# Altium schematic sheet PROC054D_AWR_Power_Decoupling.SchDoc: DECOUPLING_CAPS_1
size 558 x 431 mm; Date: Not shown in title block; ApprovedBy: Not shown in title block; CheckedBy: Not shown in title block; Author: Not shown in title block; CompanyName: Not shown in title block; DrawnBy: a0271760; Engineer: Not shown in title block; Organization: Not shown in title block; Address1: Not shown in title block; Address2: Not shown in title block; Address3: Not shown in title block; Address4: Not shown in title block; DocumentNumber: 11; Revision: Use project pAWRameter SCH_Rev; SheetNumber: 11; SheetTotal: 19; PageSetup: Record=PageOptions|CenterHorizontal=True|CenterVertical=True|PrintScale=1.00|XCorrection=1.00|YCorrection=1.00|PrintKind=0|BorderSize=5000000|LeftOffset=0|BottomOffset=0|Orientation=2|PaperLength=1000|PaperWidth=1000|Scale=100|PaperSource=15|PrintQuality=600|MediaType=1|DitherType=10|PaperKind=Letter|PrintScaleMode=1; CurrentTime: Not shown in title block; CurrentDate: Not shown in title block; Time: Not shown in title block; DocumentFullPathAndName: Not shown in title block; DocumentName: Not shown in title block; ModifiedDate: Not shown in title block; ImagePath: Not shown in title block
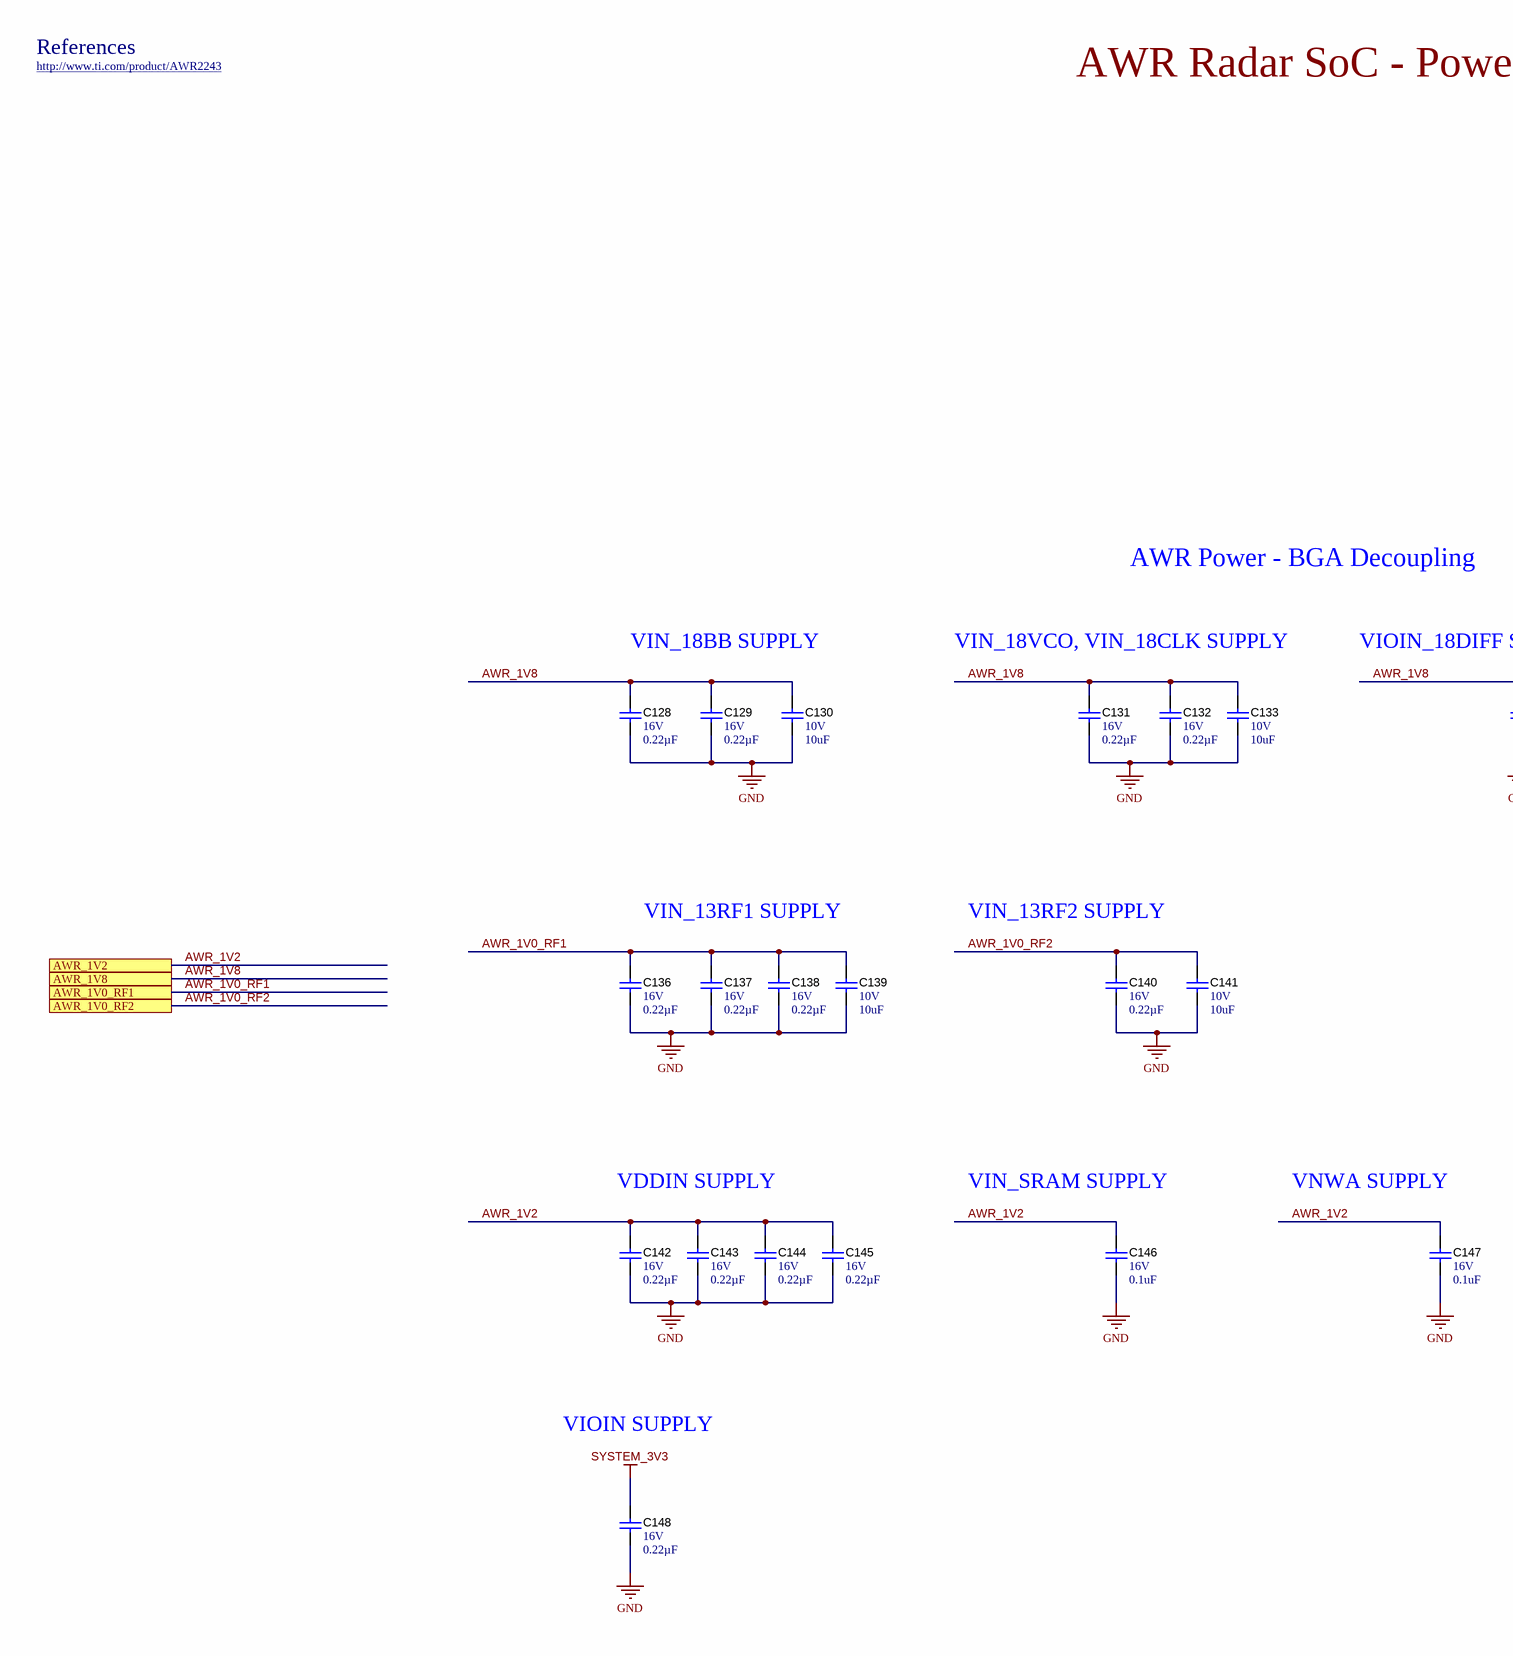
[diagram p0: PROC054D_AWR_Power_Decoupling.SchDoc, left]
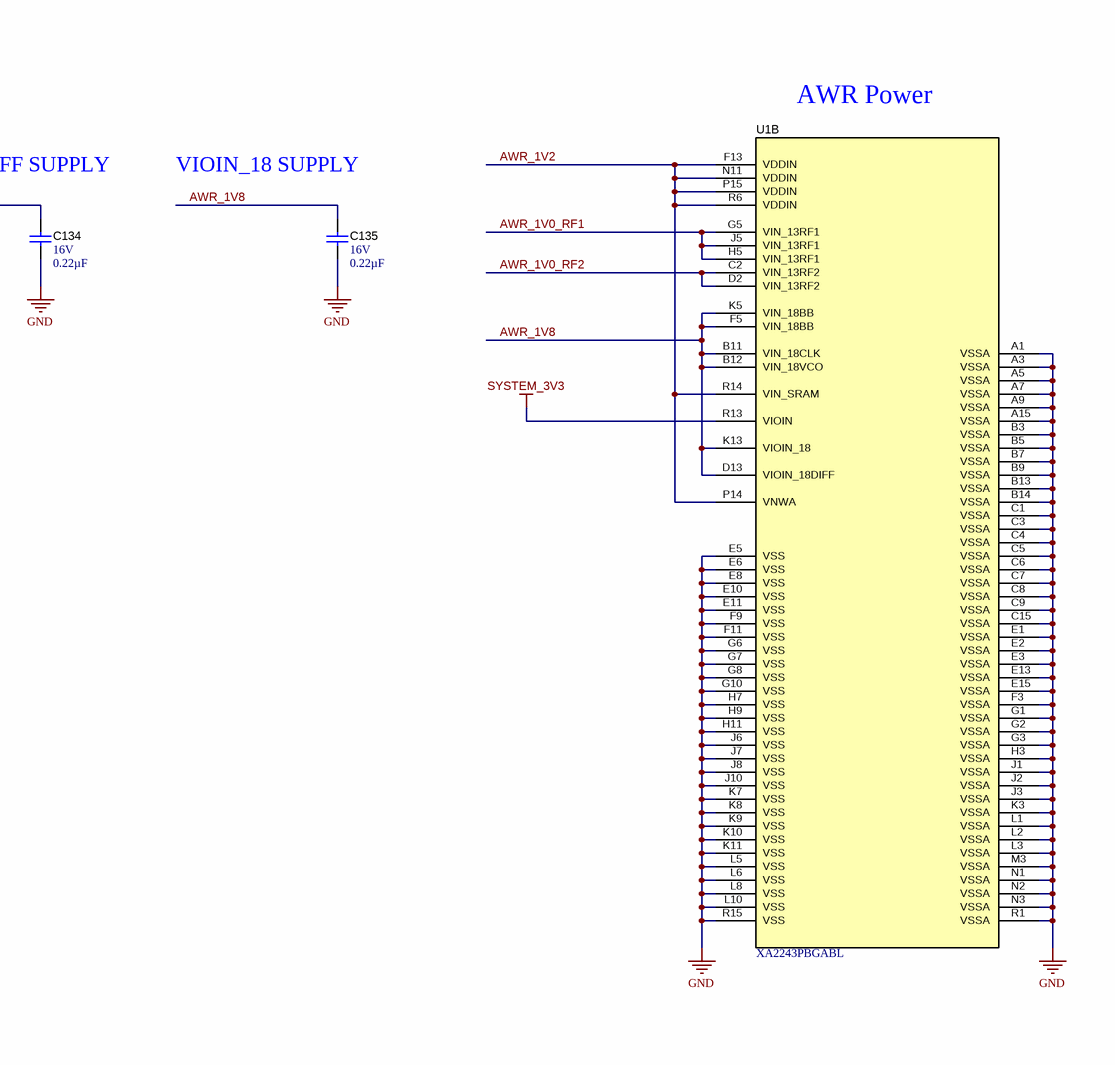
[diagram p1: PROC054D_AWR_Power_Decoupling.SchDoc, right]

## Parts
C128  VDC_V: 16V  ValueDisplayed: 0.22µF  [0402S]  (hidden comment: GCM155R71C224KE02D)
C129  VDC_V: 16V  ValueDisplayed: 0.22µF  [0402S]  (hidden comment: GCM155R71C224KE02D)
C130  VDC_V: 10V  ValueDisplayed: 10uF  [0805L]  (hidden comment: GCM21BR71A106KE22L)
C131  VDC_V: 16V  ValueDisplayed: 0.22µF  [0402S]  (hidden comment: GCM155R71C224KE02D)
C132  VDC_V: 16V  ValueDisplayed: 0.22µF  [0402S]  (hidden comment: GCM155R71C224KE02D)
C133  VDC_V: 10V  ValueDisplayed: 10uF  [0805L]  (hidden comment: GCM21BR71A106KE22L)
C134  VDC_V: 16V  ValueDisplayed: 0.22µF  [0402S]  (hidden comment: GCM155R71C224KE02D)
C135  VDC_V: 16V  ValueDisplayed: 0.22µF  [0402S]  (hidden comment: GCM155R71C224KE02D)
C136  VDC_V: 16V  ValueDisplayed: 0.22µF  [0402S]  (hidden comment: GCM155R71C224KE02D)
C137  VDC_V: 16V  ValueDisplayed: 0.22µF  [0402S]  (hidden comment: GCM155R71C224KE02D)
C138  VDC_V: 16V  ValueDisplayed: 0.22µF  [0402S]  (hidden comment: GCM155R71C224KE02D)
C139  VDC_V: 10V  ValueDisplayed: 10uF  [0805L]  (hidden comment: GCM21BR71A106KE22L)
C140  VDC_V: 16V  ValueDisplayed: 0.22µF  [0402S]  (hidden comment: GCM155R71C224KE02D)
C141  VDC_V: 10V  ValueDisplayed: 10uF  [0805L]  (hidden comment: GCM21BR71A106KE22L)
C142  VDC_V: 16V  ValueDisplayed: 0.22µF  [0402S]  (hidden comment: GCM155R71C224KE02D)
C143  VDC_V: 16V  ValueDisplayed: 0.22µF  [0402S]  (hidden comment: GCM155R71C224KE02D)
C144  VDC_V: 16V  ValueDisplayed: 0.22µF  [0402S]  (hidden comment: GCM155R71C224KE02D)
C145  VDC_V: 16V  ValueDisplayed: 0.22µF  [0402S]  (hidden comment: GCM155R71C224KE02D)
C146  VDC_V: 16V  ValueDisplayed: 0.1uF  [0402S]  (hidden comment: GCM155R71C104KA55D)
C147  VDC_V: 16V  ValueDisplayed: 0.1uF  [0402S]  (hidden comment: GCM155R71C104KA55D)
C148  VDC_V: 16V  ValueDisplayed: 0.22µF  [0402S]  (hidden comment: GCM155R71C224KE02D)
U1  XA2243PBGABL  [ABL0161A]  (part B of 2)

## Ports
AWR_1V0_RF1, AWR_1V0_RF2, AWR_1V2, AWR_1V8

## Nets
GND: C128.2 C129.2 C130.2 C131.2 C132.2 C133.2 C134.2 C135.2 C136.2 C137.2 C138.2 C139.2 C140.2 C141.2 C142.2 C143.2 C144.2 C145.2 C146.2 C147.2 C148.2 U1.A1(VSSA) U1.A3(VSSA) U1.A5(VSSA) U1.A7(VSSA) U1.A9(VSSA) U1.A15(VSSA) U1.B3(VSSA) U1.B5(VSSA) U1.B7(VSSA) U1.B9(VSSA) U1.B13(VSSA) U1.B14(VSSA) U1.C1(VSSA) U1.C3(VSSA) U1.C4(VSSA) U1.C5(VSSA) U1.C6(VSSA) U1.C7(VSSA) U1.C8(VSSA) U1.C9(VSSA) U1.C15(VSSA) U1.E1(VSSA) U1.E2(VSSA) U1.E3(VSSA) U1.E5(VSS) U1.E6(VSS) U1.E8(VSS) U1.E10(VSS) U1.E11(VSS) U1.E13(VSSA) U1.E15(VSSA) U1.F3(VSSA) U1.F9(VSS) U1.F11(VSS) U1.G1(VSSA) U1.G2(VSSA) U1.G3(VSSA) U1.G6(VSS) U1.G7(VSS) U1.G8(VSS) U1.G10(VSS) U1.H3(VSSA) U1.H7(VSS) U1.H9(VSS) U1.H11(VSS) U1.J1(VSSA) U1.J2(VSSA) U1.J3(VSSA) U1.J6(VSS) U1.J7(VSS) U1.J8(VSS) U1.J10(VSS) U1.K3(VSSA) U1.K7(VSS) U1.K8(VSS) U1.K9(VSS) U1.K10(VSS) U1.K11(VSS) U1.L1(VSSA) U1.L2(VSSA) U1.L3(VSSA) U1.L5(VSS) U1.L6(VSS) U1.L8(VSS) U1.L10(VSS) U1.M3(VSSA) U1.N1(VSSA) U1.N2(VSSA) U1.N3(VSSA) U1.R1(VSSA) U1.R15(VSS)
SYSTEM_3V3: C148.1 U1.R13(VIOIN)
AWR_1V0_RF1: C136.1 C137.1 C138.1 C139.1 U1.G5(VIN_13RF1) U1.H5(VIN_13RF1) U1.J5(VIN_13RF1) ; port AWR_1V0_RF1
AWR_1V0_RF2: C140.1 C141.1 U1.C2(VIN_13RF2) U1.D2(VIN_13RF2) ; port AWR_1V0_RF2
AWR_1V2: C142.1 C143.1 C144.1 C145.1 C146.1 C147.1 U1.F13(VDDIN) U1.N11(VDDIN) U1.P14(VNWA) U1.P15(VDDIN) U1.R6(VDDIN) U1.R14(VIN_SRAM) ; port AWR_1V2
AWR_1V8: C128.1 C129.1 C130.1 C131.1 C132.1 C133.1 C134.1 C135.1 U1.B11(VIN_18CLK) U1.B12(VIN_18VCO) U1.D13(VIOIN_18DIFF) U1.F5(VIN_18BB) U1.K5(VIN_18BB) U1.K13(VIOIN_18) ; port AWR_1V8

## Notes on the sheet
- References
- http://www.ti.com/product/AWR2243
- AWR Radar SoC - Power and Decoupling
- AWR Power - BGA Decoupling
- AWR Power
- VIN_18BB SUPPLY
- VIN_18VCO, VIN_18CLK SUPPLY
- VIOIN_18DIFF SUPPLY
- VIOIN_18 SUPPLY
- VIN_13RF1 SUPPLY
- VIN_13RF2 SUPPLY
- VDDIN SUPPLY
- VIN_SRAM SUPPLY
- VNWA SUPPLY
- VIOIN SUPPLY
- Drawn By:
- SVN Rev:
- Number:
- TID #:
- Orderable:
- Rev:
- Sheet Title:
- File:
- Project Title:
- Designed for:
- Assembly VAWRiant:
- Mod. Date:
- Sheet:
- Size:
- of
- C
- http://www.ti.com
- Texas Instruments and/or its licensors do not wAWRrant the accuracy or completeness of this specification or any information contained therein. Texas Instruments and/or its licensors do not wAWRrant that this design will meet the specifications, will be suitable for your application or fit for any pAWRticulAWR purpose, or will operate in an implementation. Texas Instruments and/or its licensors do not wAWRrant that the design is production worthy. You should completely validate and test your design implementation to confirm the system functionality for your application.
- Engineer:
- Contact:
- © Texas Instruments

## Library data of the parts
C128 C129 C131 C132 C134-C138 C140 C142-C145 C148 = CMP-0078265-1: CAP, CERM, 0.22 µF, 16 V,+/- 10%, X7R, AEC-Q200 Grade 1, 0402; Manufacturer: MuRata; TaMin_C: -55°C; Polarized: N; SizeAreaWB_mm2: 3; U/M: EA; Value: 0.22uF; TaMax_C: 125°C; SizeZ_mm: 0.6; SizeX_mm: 1; SizeY_mm: 0.5; Cap_Case: 0402; CompType: Capacitor; AEC Qualified: Y; Cap_F: 220nF; AEC Category: Q200; ComponentLink1URL: http://psearch.en.murata.com/capacitor/product/GCM155R71C224KE02%23.pdf; Supplier Part Number 2: 81-GCM155R71C224KE2D; Supplier 2: Mouser; TempCo: X7R; RoHS: Y; MountType: SMT; Supplier 1: Digi-Key; PackageReference: 0402; Tolerance_%: 10%; Value2: 16V; SizeArea_mm2: 0.5; PartNumber: GCM155R71C224KE02D; ComponentLink1Description: Datasheet link; AEC Grade: 1; Supplier Part Number 1: 490-10671-1-ND; Technology: Ceramic
C130 C133 C139 C141 = CMP-0008017-2: CAP, CERM, 10 uF, 10 V, +/- 10%, X7R, 0805; Manufacturer: MuRata; TaMin_C: -55°C; Polarized: N; SizeAreaWB_mm2: 6.75; Value1: Unknown; U/M: EA; Value: 10uF; TaMax_C: 125°C; SizeZ_mm: 1.45; SizeX_mm: 2; SizeY_mm: 1.25; Cap_Case: 0805; SizeArea_mm2: 2.5; CompType: Capacitor; Cap_F: 10µF; AEC Category: Q200; Supplier Part Number 2: 06AC6014; Publisher: Texas Instruments; Supplier 2: Newark; Supplier Part Number 3: 81-GCM21BR71A106KE2L; TempCo: X7R; Supplier 3: Mouser; Published: 2008-06-19; RoHS: Y; MountType: SMT; Supplier 1: Digi-Key; PackageReference: 0805; Tolerance_%: 10%; Value2: 10V; LatestRevisionDate: 2017-03-09; PartNumber: GCM21BR71A106KE22L; AEC Qualified: ?; ComponentLink1Description: Datasheet link; Supplier Part Number 1: 490-10674-1-ND; Technology: Ceramic; ComponentLink1URL: http://www.murata.com/products/catalog/pdf/c03e.pdf
C146 C147 = CMP-0006351-2: CAP, CERM, 0.1 uF, 16 V, +/- 10%, X7R, 0402; Manufacturer: MuRata; TaMin_C: -55°C; Polarized: N; SizeAreaWB_mm2: 3; Value1: Unknown; U/M: EA; Value: 0.1uF; TaMax_C: 125°C; SizeZ_mm: 0.6; SizeX_mm: 1; SizeY_mm: 0.5; Cap_Case: 0402; Cap_F: 100nF; AEC Category: Q200; Publisher: Texas Instruments; TempCo: X7R; Published: 2008-06-19; RoHS: Y; MountType: SMT; Supplier 1: Digi-Key; PackageReference: 0402; Tolerance_%: 10%; Value2: 16V; SizeArea_mm2: 0.5; CompType: Capacitor; LatestRevisionDate: 2017-03-09; PartNumber: GCM155R71C104KA55D; AEC Qualified: ?; ComponentLink1Description: Datasheet link; Supplier Part Number 1: 490-4759-2-ND; Technology: Ceramic; ComponentLink1URL: http://psearch.murata.com/capacitor/product/GCM155R71C104KA55%23.pdf
U1 = CMP-0082537-1: Single Chip 77 and 79 GHz FMCW Transceiver, ABL0161A (FCBGA-161); Alternate Manufacturer: Texas Instruments; SizeAreaWB_mm2: 153.76; Rating: Automotive; SizeZ_mm: 1.17; SizeX_mm: 10.4; SizeArea_mm2: 108.16; CompType: IC; AEC Qualified: Y; AEC Category: Q200; ComponentLink1URL: http://www.ti.com/lit/ds/symlink/awr2243-q1.pdf; PackageDescription: FCBGA-161; MountType: SMT; ComponentLink2URL: http://www.ti.com/product/awr2243-q1; ComponentLink3Description: Online Datasheet; ComponentLink2Description: Product Folder; Manufacturer: Texas Instruments; ComponentLink3URL: http://www.ti.com/product/awr2243-q1/datasheet; PackageReference: ABL0161A; SizeY_mm: 10.4; PartNumber: XA2243PBGABL; ComponentLink1Description: Datasheet Link; PartId: 2